# EAGLE design NixieClock (EAGLE 9.5.1)
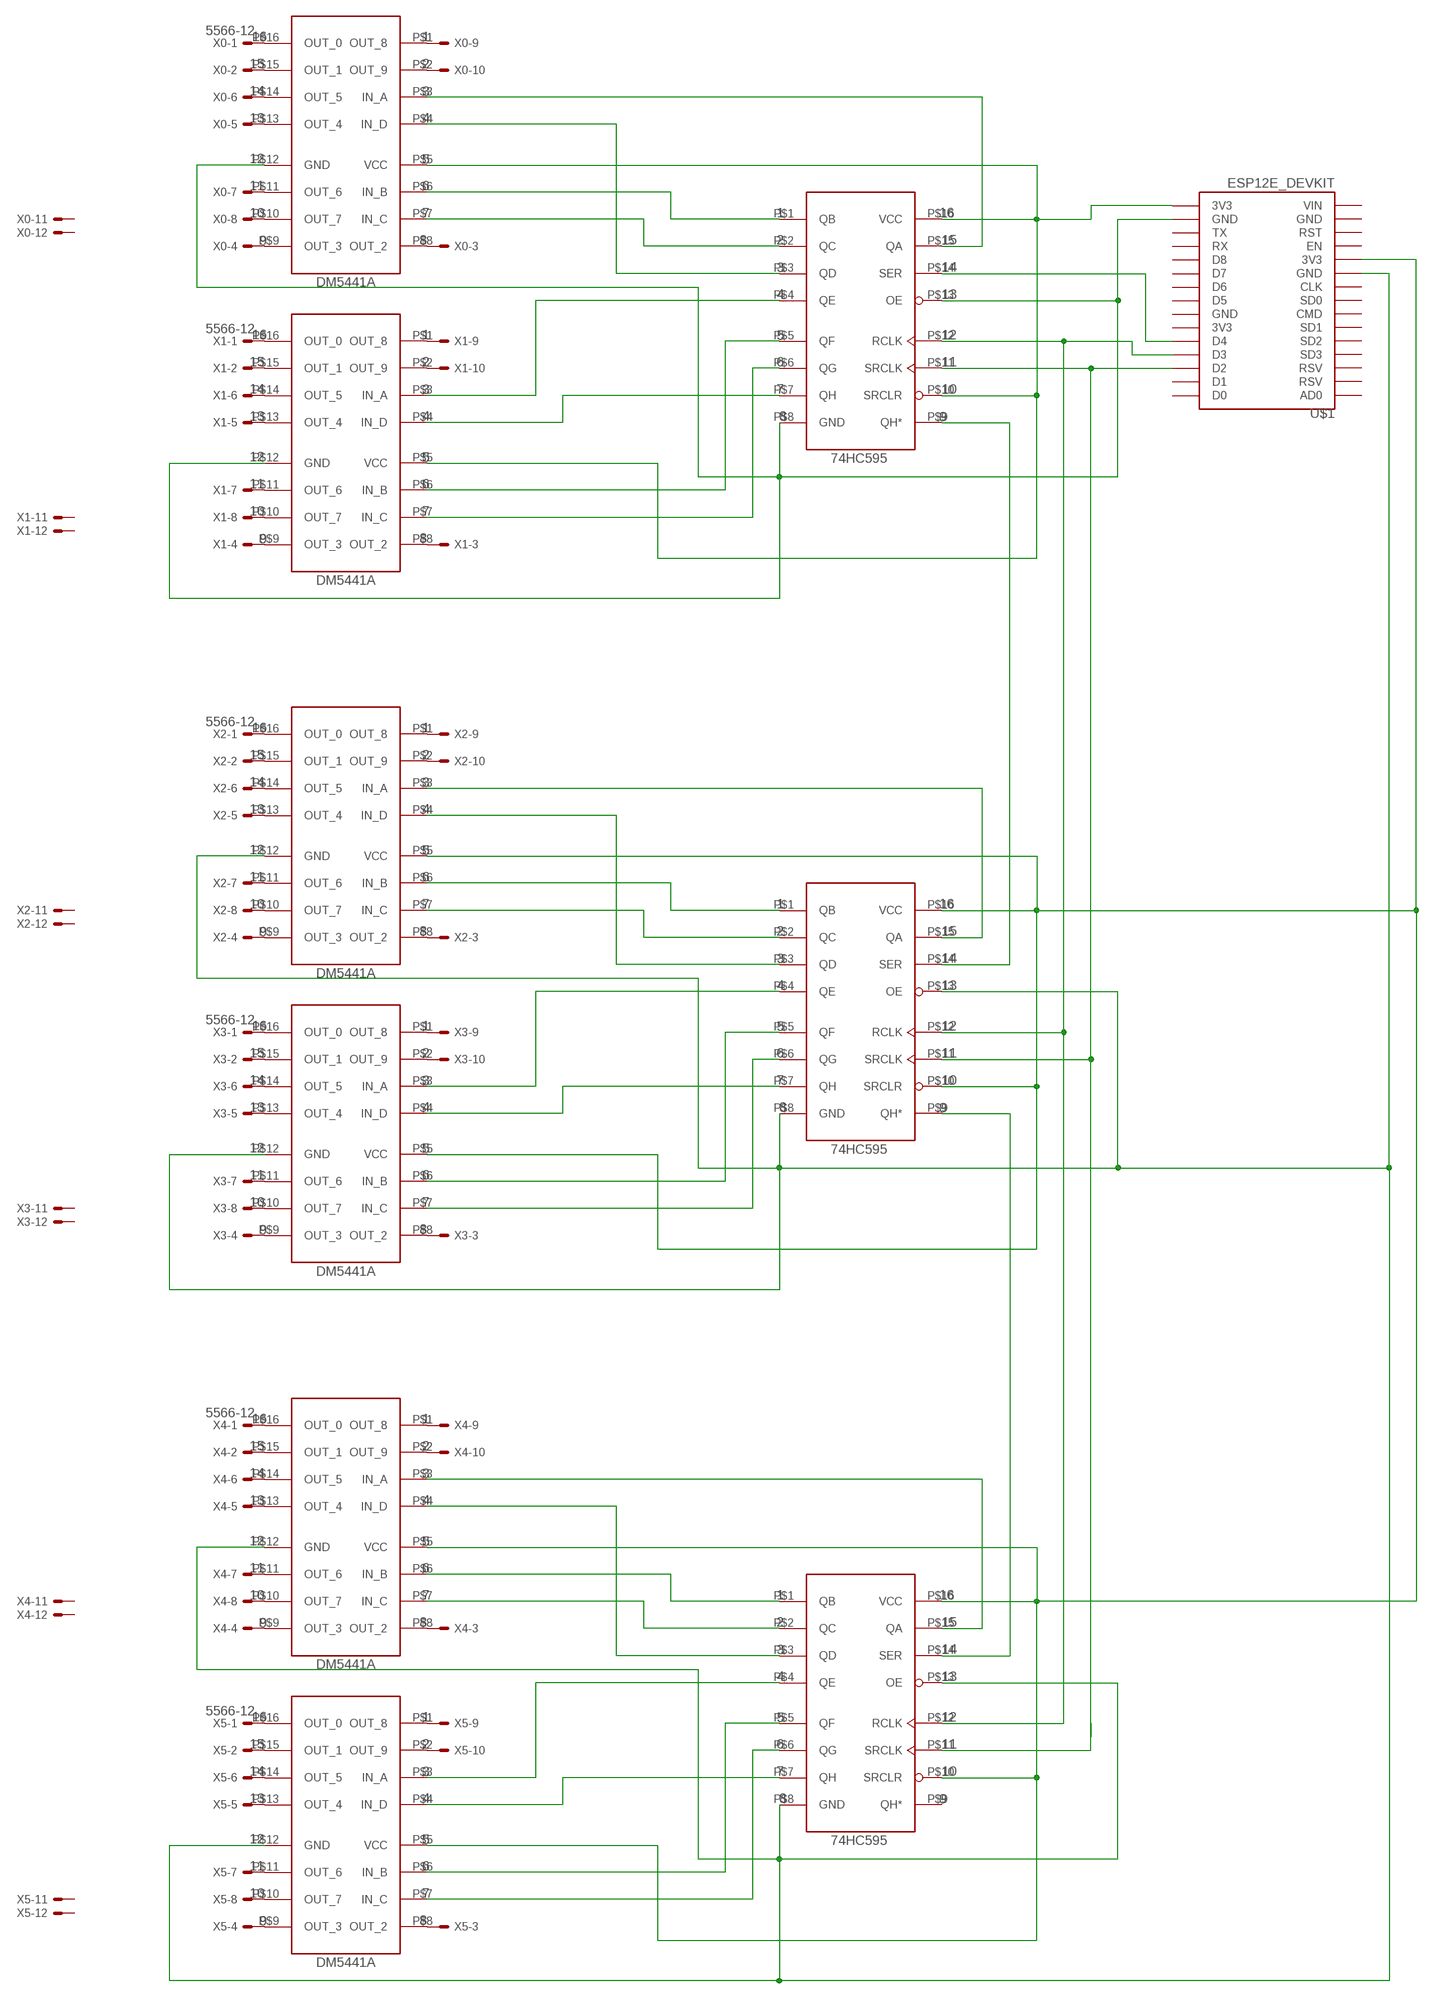
[diagram p0: schematic, sheet 1]

## Parts
BCD0  DM5441ADIP-16  [DIP-16]
BCD1  DM5441ADIP-16  [DIP-16]
BCD2  DM5441ADIP-16  [DIP-16]
BCD3  DM5441ADIP-16  [DIP-16]
BCD4  DM5441ADIP-16  [DIP-16]
BCD5  DM5441ADIP-16  [DIP-16]
SR0  SN74HC595NDIP-16  [DIP-16]
SR1  SN74HC595NDIP-16  [DIP-16]
SR2  SN74HC595NDIP-16  [DIP-16]
U$1  ESP12E_DEVKIT  [ESP12E_DEVKIT]
X0  5566-12  [5566-12]
X1  5566-12  [5566-12]
X2  5566-12  [5566-12]
X3  5566-12  [5566-12]
X4  5566-12  [5566-12]
X5  5566-12  [5566-12]

## Nets
N$1: BCD2.P$3(IN_A) SR1.P$15(QA)
N$3: BCD0.P$3(IN_A) SR0.P$15(QA)
N$4: BCD0.P$6(IN_B) SR0.P$1(QB)
N$5: BCD0.P$7(IN_C) SR0.P$2(QC)
N$6: BCD0.P$4(IN_D) SR0.P$3(QD)
N$7: BCD1.P$3(IN_A) SR0.P$4(QE)
N$8: BCD1.P$6(IN_B) SR0.P$5(QF)
N$9: BCD1.P$7(IN_C) SR0.P$6(QG)
N$10: BCD1.P$4(IN_D) SR0.P$7(QH)
N$11: SR0.P$14(SER) U$1.D4
N$12: BCD0.P$8(OUT_2) X0.3
N$13: BCD2.P$5(VCC) BCD3.P$5(VCC) BCD4.P$5(VCC) BCD5.P$5(VCC) SR1.P$10(SRCLR) SR1.P$16(VCC) SR2.P$10(SRCLR) SR2.P$16(VCC) U$1.3V3@0(3V3)
N$14: BCD0.P$11(OUT_6) X0.7
N$15: BCD0.P$10(OUT_7) X0.8
N$16: BCD0.P$9(OUT_3) X0.4
N$17: BCD0.P$2(OUT_9) X0.10
N$18: BCD0.P$1(OUT_8) X0.9
N$19: BCD0.P$16(OUT_0) X0.1
N$20: BCD0.P$15(OUT_1) X0.2
N$21: BCD0.P$14(OUT_5) X0.6
N$22: BCD0.P$13(OUT_4) X0.5
N$23: BCD2.P$12(GND) BCD3.P$12(GND) BCD4.P$12(GND) BCD5.P$12(GND) SR1.P$8(GND) SR1.P$13(OE) SR2.P$8(GND) SR2.P$13(OE) U$1.GND@0(GND)
N$25: BCD2.P$6(IN_B) SR1.P$1(QB)
N$26: BCD2.P$7(IN_C) SR1.P$2(QC)
N$27: SR0.P$9(QH*) SR1.P$14(SER)
N$28: BCD2.P$4(IN_D) SR1.P$3(QD)
N$29: BCD3.P$3(IN_A) SR1.P$4(QE)
N$30: BCD1.P$8(OUT_2) X1.3
N$31: BCD1.P$11(OUT_6) X1.7
N$32: BCD1.P$10(OUT_7) X1.8
N$33: BCD1.P$9(OUT_3) X1.4
N$34: BCD1.P$2(OUT_9) X1.10
N$35: BCD1.P$1(OUT_8) X1.9
N$36: BCD1.P$16(OUT_0) X1.1
N$37: BCD1.P$15(OUT_1) X1.2
N$38: BCD1.P$14(OUT_5) X1.6
N$39: BCD1.P$13(OUT_4) X1.5
N$40: BCD3.P$6(IN_B) SR1.P$5(QF)
N$41: BCD3.P$7(IN_C) SR1.P$6(QG)
N$42: BCD3.P$4(IN_D) SR1.P$7(QH)
N$43: SR0.P$11(SRCLK) SR1.P$11(SRCLK) SR2.P$11(SRCLK) U$1.D2
N$44: BCD0.P$5(VCC) BCD1.P$5(VCC) SR0.P$10(SRCLR) SR0.P$16(VCC) U$1.3V3@2(3V3)
N$45: BCD0.P$12(GND) BCD1.P$12(GND) SR0.P$8(GND) SR0.P$13(OE) U$1.GND@3(GND)
N$46: SR1.P$9(QH*) SR2.P$14(SER)
N$47: BCD2.P$8(OUT_2) X2.3
N$48: BCD2.P$11(OUT_6) X2.7
N$49: BCD2.P$10(OUT_7) X2.8
N$50: BCD2.P$9(OUT_3) X2.4
N$51: BCD2.P$2(OUT_9) X2.10
N$52: BCD2.P$1(OUT_8) X2.9
N$53: BCD2.P$16(OUT_0) X2.1
N$54: BCD2.P$15(OUT_1) X2.2
N$55: BCD2.P$14(OUT_5) X2.6
N$56: BCD2.P$13(OUT_4) X2.5
N$58: BCD3.P$8(OUT_2) X3.3
N$59: BCD3.P$11(OUT_6) X3.7
N$60: BCD3.P$10(OUT_7) X3.8
N$61: BCD3.P$9(OUT_3) X3.4
N$62: BCD3.P$2(OUT_9) X3.10
N$63: BCD3.P$1(OUT_8) X3.9
N$64: BCD3.P$16(OUT_0) X3.1
N$65: BCD3.P$15(OUT_1) X3.2
N$66: BCD3.P$14(OUT_5) X3.6
N$67: BCD3.P$13(OUT_4) X3.5
N$69: BCD4.P$3(IN_A) SR2.P$15(QA)
N$70: BCD4.P$6(IN_B) SR2.P$1(QB)
N$71: BCD4.P$7(IN_C) SR2.P$2(QC)
N$72: BCD4.P$4(IN_D) SR2.P$3(QD)
N$73: BCD5.P$3(IN_A) SR2.P$4(QE)
N$74: BCD5.P$6(IN_B) SR2.P$5(QF)
N$75: BCD5.P$7(IN_C) SR2.P$6(QG)
N$76: BCD5.P$4(IN_D) SR2.P$7(QH)
N$78: SR0.P$12(RCLK) SR1.P$12(RCLK) SR2.P$12(RCLK) U$1.D3
N$81: BCD4.P$8(OUT_2) X4.3
N$82: BCD4.P$11(OUT_6) X4.7
N$83: BCD4.P$10(OUT_7) X4.8
N$84: BCD4.P$9(OUT_3) X4.4
N$85: BCD4.P$2(OUT_9) X4.10
N$86: BCD4.P$1(OUT_8) X4.9
N$87: BCD4.P$16(OUT_0) X4.1
N$88: BCD4.P$15(OUT_1) X4.2
N$89: BCD4.P$14(OUT_5) X4.6
N$90: BCD4.P$13(OUT_4) X4.5
N$92: BCD5.P$8(OUT_2) X5.3
N$93: BCD5.P$11(OUT_6) X5.7
N$94: BCD5.P$10(OUT_7) X5.8
N$95: BCD5.P$9(OUT_3) X5.4
N$96: BCD5.P$2(OUT_9) X5.10
N$97: BCD5.P$1(OUT_8) X5.9
N$98: BCD5.P$16(OUT_0) X5.1
N$99: BCD5.P$15(OUT_1) X5.2
N$100: BCD5.P$14(OUT_5) X5.6
N$101: BCD5.P$13(OUT_4) X5.5
Unconnected: SR2.P$9(QH*) U$1.3V3@1(3V3) U$1.AD0 U$1.CLK U$1.CMD U$1.D0 U$1.D1 U$1.D5 U$1.D6 U$1.D7 U$1.D8 U$1.EN U$1.GND@1(GND) U$1.GND@2(GND) U$1.RST U$1.RSV@0(RSV) U$1.RSV@1(RSV) U$1.RX U$1.SD0 U$1.SD1 U$1.SD2 U$1.SD3 U$1.TX U$1.VIN X0.11 X0.12 X1.11 X1.12 X2.11 X2.12 X3.11 X3.12 X4.11 X4.12 X5.11 X5.12

## Library data of the parts
BCD0 BCD1-BCD5 = DM5441A:DM5441A; AVAILABILITY: Unavailable; DESCRIPTION: Shift Register Single 8 Bit Serial To Serial Parallel 16 Pin Plastic DIP Tube; MF: Texas Instruments; MP: SN74HC595N; PACKAGE: PDIP-16 Texas Instruments; PRICE: None
SR0 SR1 SR2 = SN74HC595N:SN74HC595N; AVAILABILITY: Unavailable; DESCRIPTION: Shift Register Single 8 Bit Serial To Serial Parallel 16 Pin Plastic DIP Tube; MF: Texas Instruments; MP: SN74HC595N; PACKAGE: PDIP-16 Texas Instruments; PRICE: None
U$1 = ESP12E_DEVKIT:ESP12E_DEVKIT: ESP12E DEVKIT BOARD
X0 X1-X5 = con-molex:5566-12: Mini FIT connector 12 pol Source: http://www.molex.com; MF: MOLEX; OC_FARNELL: unknown; OC_NEWARK: unknown

## Board
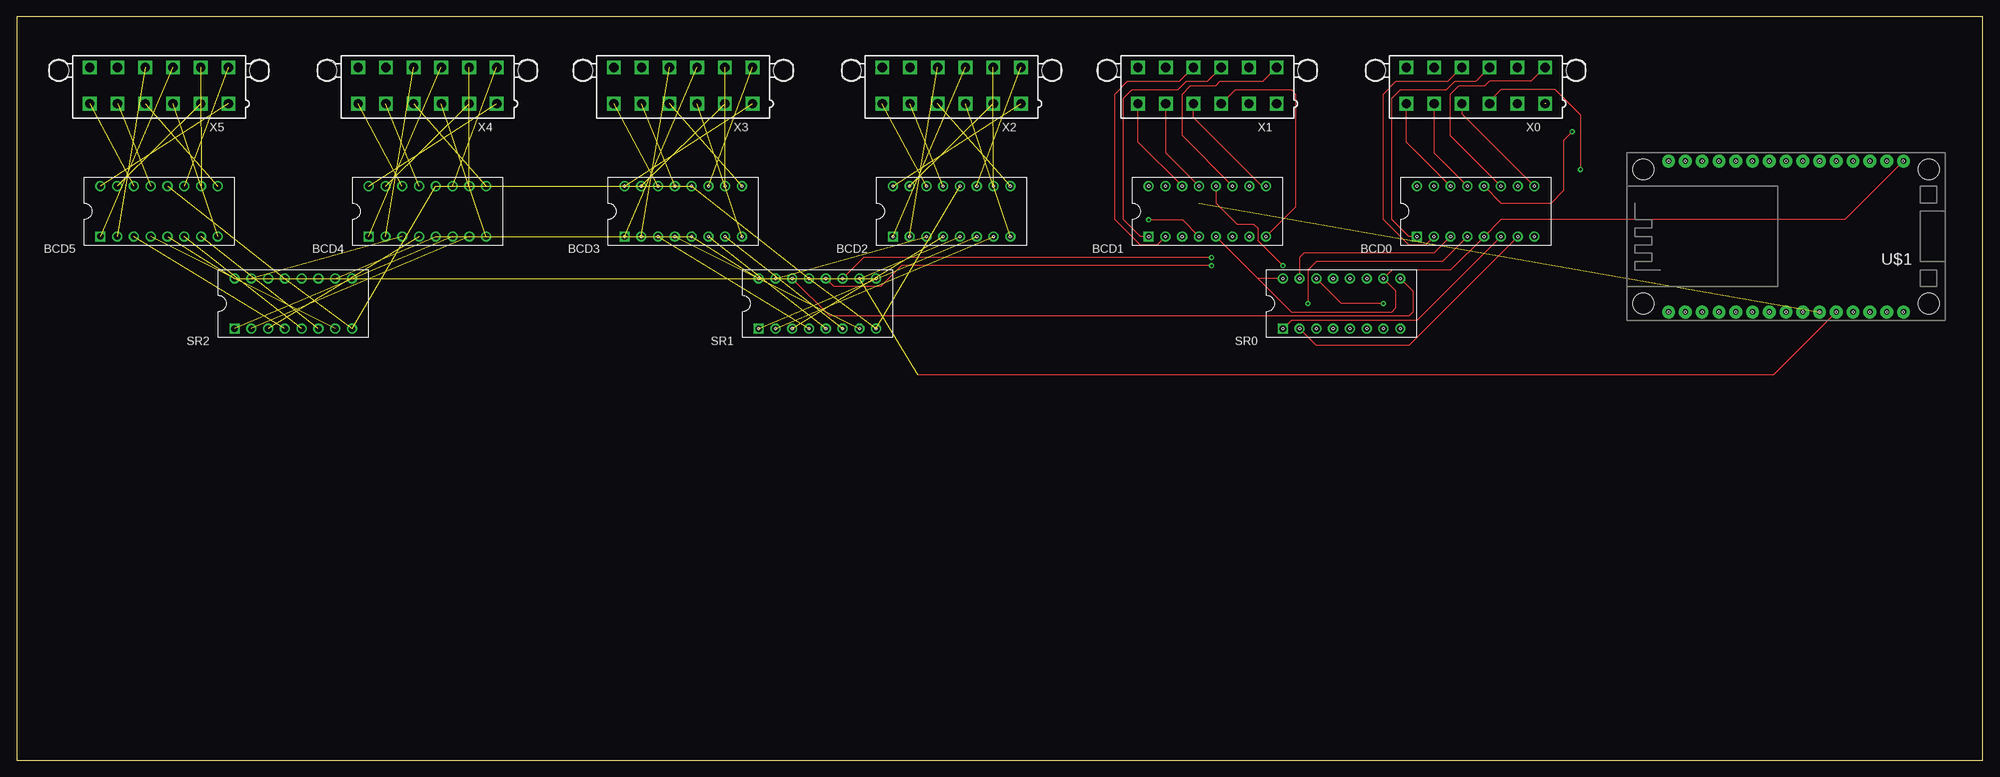
[diagram p1: board, top side]
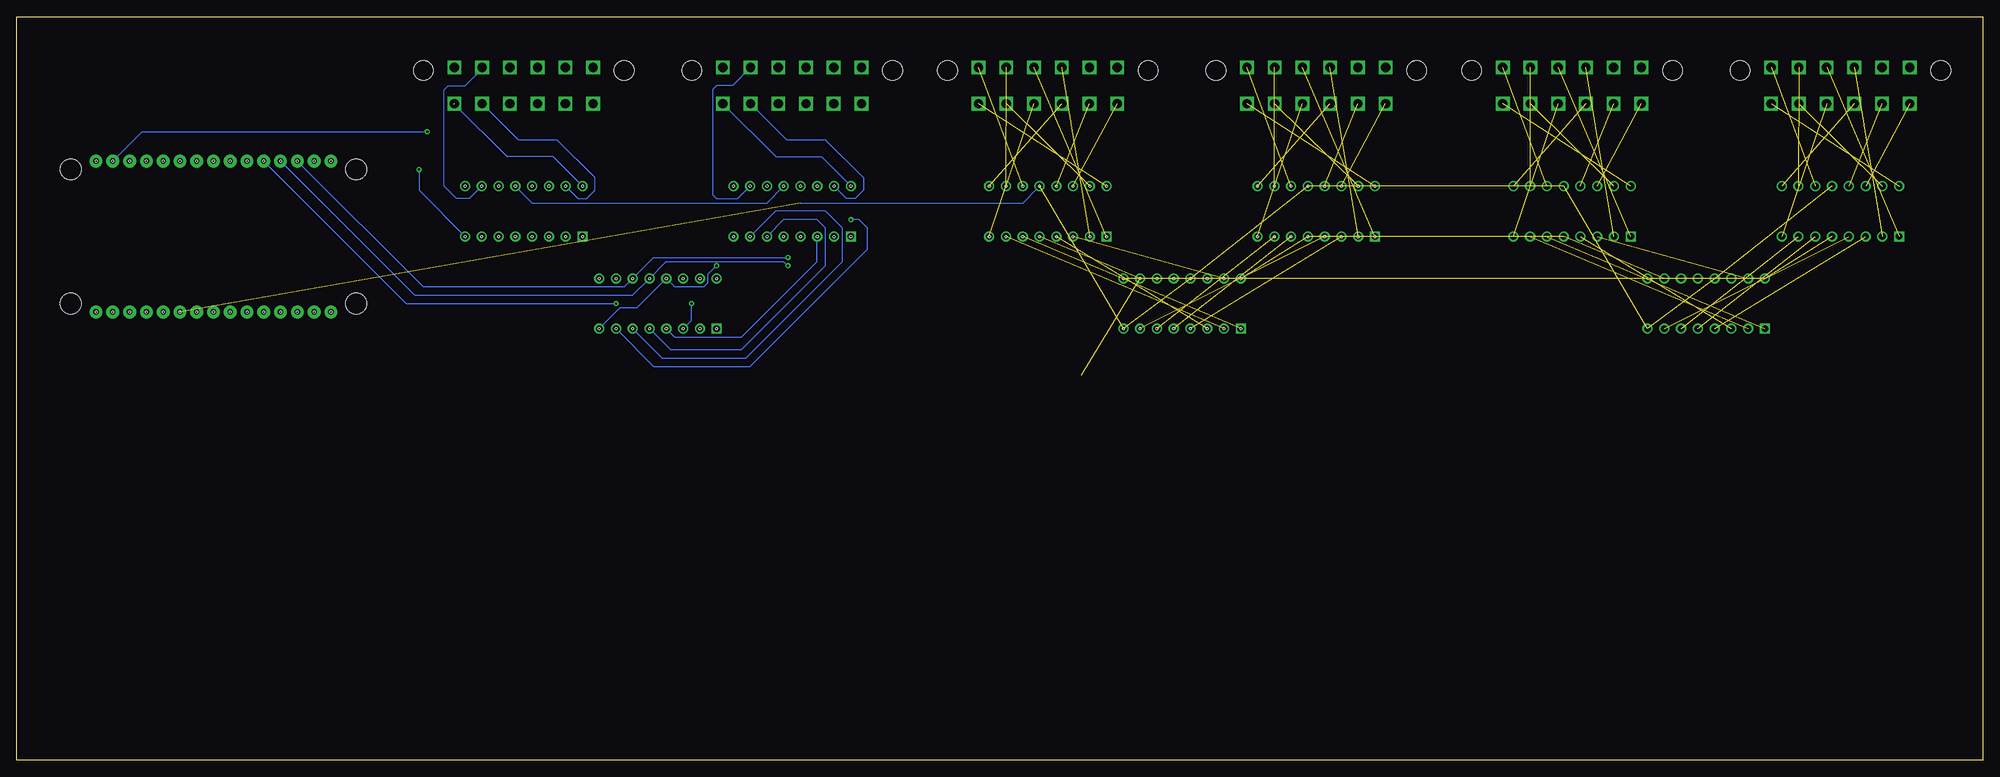
[diagram p2: board, bottom side, seen from below]

Size 297.79 x 112.7 mm. Coordinates in mm from the lower left corner, seen from the top.
Outline: 0,0 297.79,0 297.79,112.7 0,112.7 0,0
Copper layers (1*16): Top 0.035mm / dielectric 1.5mm / Bottom 0.035mm
Design rules "default": minimum track width 6mil, minimum drill 0.35mm, track to track 6mil, track to pad 6mil, pad to pad 6mil, via to via 6mil, smd to smd 6mil, copper to edge 40mil, drill to drill 6mil, minimum pad ring 10mil, minimum via ring 8mil, stop-mask expansion 4mil, vias tented up to drill 0mil, thermal gap 10mil
Holes 0.35 mm at 171.45,86.99 173.99,86.99 176.53,86.99 179.07,86.99 181.61,86.99 184.15,86.99 186.69,86.99 189.23,86.99 189.23,79.38 186.69,79.38 184.15,79.38 181.61,79.38 179.07,79.38 176.53,79.38 173.99,79.38 171.45,79.38 186.69,79.38 212.09,79.38 212.09,86.99 214.63,86.99 217.17,86.99 217.17,79.38 214.63,79.38 219.71,79.38 219.71,86.99 222.25,86.99 224.79,86.99 227.33,86.99 229.87,86.99 229.87,79.38 227.33,79.38 224.79,79.38 222.25,79.38 199.39,65.41 201.93,65.41 204.47,65.41 207.01,65.41 209.55,65.41 196.85,65.41 194.31,65.41 191.77,65.41 191.77,73.03 194.31,73.03 196.85,73.03 199.39,73.03 201.93,73.03 204.47,73.03 207.01,73.03 209.55,73.03 132.72,86.99 135.25,86.99 137.79,86.99 140.33,86.99 142.88,86.99 145.41,86.99 147.95,86.99 150.5,86.99 150.5,79.38 147.95,79.38 145.41,79.38 142.88,79.38 140.33,79.38 137.79,79.38 135.25,79.38 132.72,79.38 130.17,73.03 127.63,73.03 125.09,73.03 122.55,73.03 120.01,73.03 117.47,73.03 114.93,73.03 112.39,73.03 112.39,65.41 114.93,65.41 117.47,65.41 120.01,65.41 122.55,65.41 125.09,65.41 127.63,65.41 130.17,65.41 92.07,86.99 92.07,79.38 94.61,79.38 94.61,86.99 97.16,86.99 97.16,79.38 99.69,79.38 99.69,86.99 102.23,86.99 102.23,79.38 104.77,79.38 104.77,86.99 107.31,86.99 107.31,79.38 109.85,79.38 109.85,86.99 201.93,73.03 199.39,73.03 204.47,73.03

### Footprints (pad centres in the part's own frame; a part is rotated, then mirrored left to right if it is on the bottom)
DIP-16 = drill 1.016 square: P$1 -3.81,8.89 | drill 1.016: P$2 -3.81,6.35; P$3 -3.81,3.81; P$4 -3.81,1.27; P$5 -3.81,-1.27; P$6 -3.81,-3.81; P$7 -3.81,-6.35; P$8 -3.81,-8.89; P$9 3.81,-8.89; P$10 3.81,-6.35; P$11 3.81,-3.81; P$12 3.81,-1.27; P$13 3.81,1.27; P$14 3.81,3.81; P$15 3.81,6.35; P$16 3.81,8.89
ESP12E_DEVKIT = drill 0.8 pad 1.93: 3V3@0 -11.43,-7.62; 3V3@1 11.43,5.08; 3V3@2 11.43,-17.78; AD0 -11.43,17.78; CLK -11.43,-2.54; CMD -11.43,2.54; D0 11.43,17.78; D1 11.43,15.24; D2 11.43,12.7; D3 11.43,10.16; D4 11.43,7.62; D5 11.43,0; D6 11.43,-2.54; D7 11.43,-5.08; D8 11.43,-7.62; EN -11.43,-10.16; GND@0 -11.43,-5.08; GND@1 -11.43,-15.24; GND@2 11.43,2.54; GND@3 11.43,-15.24; RST -11.43,-12.7; RSV@0 -11.43,15.24; RSV@1 -11.43,12.7; RX 11.43,-10.16; SD0 -11.43,0; SD1 -11.43,5.08; SD2 -11.43,7.62; SD3 -11.43,10.16; TX 11.43,-12.7; VIN -11.43,-17.78 | hole 3.2: -10.16,21.59; 10.16,21.59; 10.16,-21.59; -10.16,-21.59 | hole 0.35: -11.43,-17.78; -11.43,-15.24; -11.43,-12.7; -11.43,-10.16; -11.43,-7.62; -11.43,-5.08; -11.43,-2.54; -11.43,0; -11.43,2.54; -11.43,5.08; -11.43,7.62; -11.43,10.16; -11.43,12.7; -11.43,15.24; -11.43,17.78; 11.43,17.78; 11.43,15.24; 11.43,12.7; 11.43,10.16; 11.43,7.62; 11.43,5.08; 11.43,2.54; 11.43,0; 11.43,-2.54; 11.43,-5.08; 11.43,-7.62; 11.43,-10.16; 11.43,-12.7; 11.43,-15.24; 11.43,-17.78
5566-12 = drill 1.4 square: 1 10.5,-2.75; 2 6.3,-2.75; 3 2.1,-2.75; 4 -2.1,-2.75; 5 -6.3,-2.75; 6 -10.5,-2.75; 7 10.5,2.75; 8 6.3,2.75; 9 2.1,2.75; 10 -2.1,2.75; 11 -6.3,2.75; 12 -10.5,2.75 | hole 3: 15.2,2.29; -15.2,2.29

### Placement (x,y rotation side)
BCD0  220.98,83.19 90 top
BCD1  180.34,83.19 90 top
BCD2  141.6,83.19 90 top
BCD3  100.96,83.19 90 top
BCD4  62.23,83.19 90 top
BCD5  21.59,83.19 90 top
SR0  200.66,69.22 90 top
SR1  121.28,69.22 90 top
SR2  41.91,69.22 90 top
U$1  267.97,79.38 90 top
X0  220.98,102.23 0 top
X1  180.34,102.23 0 top
X2  141.6,102.23 0 top
X3  100.96,102.23 0 top
X4  62.23,102.23 0 top
X5  21.59,102.23 0 top

### Tracks (layer width: path | path; a pad name or v marks a point on that pad's centre or on a via)
N$1  (1 unrouted)
N$3
  Top 0.152: BCD0.P$3 214.63,76.83 194.94,76.83 194.31,76.2 SR0.P$15
N$4
  Top 0.152: BCD0.P$6 212.09,66.67 193.04,66.67 SR0.P$1
N$5
  Top 0.152: BCD0.P$7 210.82,62.86 196.85,62.86 SR0.P$2
N$6  (via drill 0.35)
  Top 0.152: BCD0.P$4 215.9,75.56 196.85,75.56 195.58,74.3 v195.58,69.22
  Bottom 0.152: SR0.P$3 195.58,66.67 v195.58,69.22
N$7
  Bottom 0.152: SR0.P$4 198.12,64.14 187.96,64.14 176.53,75.56 BCD1.P$3
N$8
  Bottom 0.152: SR0.P$5 198.75,62.23 187.96,62.23 175.26,74.93 175.26,80.64 176.53,81.91 181.61,81.91 BCD1.P$6
N$9
  Bottom 0.152: SR0.P$6 200.02,60.96 187.32,60.96 172.72,75.56 172.72,80.64 175.26,83.19 182.88,83.19 BCD1.P$7
N$10  (via drill 0.35)
  Top 0.152: v171.45,81.91 176.53,81.91 BCD1.P$4
  Bottom 0.152: SR0.P$7 201.29,59.69 186.69,59.69 168.91,77.47 168.91,80.64 170.18,81.91 v171.45,81.91
N$11  (via drill 0.35)
  Top 0.152: v207.01,69.22 200.66,69.22 SR0.P$14
  Bottom 0.152: U$1.D4 238.76,69.22 v207.01,69.22
N$12  (via drill 0.35)
  Top 0.152: X0.3 223.08,99.89 224.79,101.6 233.04,101.6 236.85,97.79 v236.85,89.53
  Bottom 0.152: BCD0.P$8 236.85,86.36 v236.85,89.53
N$13  (8 unrouted)
  Top 0.152: U$1.3V3@0 266.06,58.42 136.53,58.42
N$14
  Top 0.152: BCD0.P$11 217.17,94.61 217.17,100.97 218.44,102.23 222.38,102.23 223.01,102.87 229.37,102.87 X0.7
N$15
  Top 0.152: X0.8 227.28,104.83
  Bottom 0.152: 227.28,104.72 227.28,104.77 | 227.28,104.77 X0.8 | BCD0.P$10 229.24,85.09 231.14,85.09 233.04,86.99 233.04,101.6 232.41,102.23 229.82,102.23 227.28,104.77
N$16
  Top 0.152: X0.4 218.88,97.98 BCD0.P$9
N$17
  Top 0.152: BCD0.P$2 213.36,78.1 210.82,78.1 207.01,81.91 207.01,100.97 208.91,102.87 216.76,102.87 X0.10
N$18
  Top 0.152: BCD0.P$1 210.82,79.38 208.28,81.91 208.28,100.33 209.55,101.6 216.53,101.6 217.81,102.87 220.98,102.87 221.27,103.16 221.27,103.17 X0.9
N$19  (1 unrouted)
  Bottom 0.152: BCD0.P$16 216.53,91.44 223.52,91.44 231.56,99.48
N$20
  Bottom 0.152: BCD0.P$15 212.72,85.09 211.45,85.09 210.19,86.36 210.19,88.27 215.9,93.98 221.77,93.98 X0.2
N$21
  Top 0.152: X0.6 210.48,93.69 BCD0.P$14
N$22
  Top 0.152: BCD0.P$13 214.68,92.02 X0.5
N$23  (8 unrouted)
  Bottom 0.152: BCD2.P$12 145.41,84.45 179.07,84.45
N$25  (1 unrouted)
N$26  (1 unrouted)
N$27
  Top 0.152: SR0.P$9 211.45,71.12 211.45,67.94 210.82,67.31 123.19,67.31 SR1.P$14
N$28  (1 unrouted)
N$29  (1 unrouted)
N$30
  Top 0.152: X1.3 184.56,101.6 193.04,101.6 193.67,100.97 193.67,83.82 BCD1.P$8
N$31
  Top 0.152: BCD1.P$11 176.53,94.61 176.53,100.97 177.8,102.23 181.61,102.23 182.25,102.87 188.72,102.87 X1.7
N$32
  Bottom 0.152: X1.8 189.39,102.23 191.77,102.23 192.41,101.6 192.41,85.72 191.77,85.09 188.59,85.09 BCD1.P$10
N$33
  Top 0.152: X1.4 178.24,97.35 188.59,86.99 BCD1.P$9
N$34
  Top 0.152: BCD1.P$2 172.72,78.1 170.18,78.1 166.37,81.91 166.37,100.97 168.27,102.87 176.12,102.87 X1.10
N$35
  Top 0.152: BCD1.P$1 170.18,79.38 167.64,81.91 167.64,100.33 168.91,101.6 175.89,101.6 177.16,102.87 180.34,102.87 182.44,104.97 X1.9
N$36
  Bottom 0.152: BCD1.P$16 175.89,91.44 182.79,91.44 X1.1
N$37
  Bottom 0.152: BCD1.P$15 172.08,85.09 170.81,85.09 169.54,86.36 169.54,88.27 175.26,93.98 181.13,93.98 X1.2
N$38
  Top 0.152: X1.6 169.84,93.69 BCD1.P$14
N$39
  Top 0.152: BCD1.P$13 174.04,92.02 X1.5
N$40  (1 unrouted)
N$41  (1 unrouted)
N$42  (1 unrouted)
N$43  (via drill 0.35)  (1 unrouted)
  Top 0.152: v180.97,76.2 128.27,76.2 SR1.P$11
  Bottom 0.152: U$1.D2 236.22,71.75 205.74,71.75 SR0.P$11 201.29,76.2 v180.97,76.2
N$44
  Top 0.152: U$1.3V3@2 276.86,81.91 224.79,81.91 BCD0.P$5 217.17,74.3 208.28,74.3 SR0.P$10 208.91,71.12 208.91,68.58 208.28,67.94 193.04,67.94 BCD1.P$5 187.96,73.03 SR0.P$16
N$45  (via drill 0.35)
  Top 0.152: BCD1.P$12 181.61,84.45 184.78,81.28 187.32,81.28 187.96,80.64 187.96,78.74 v191.77,74.93 | v235.58,95.25 234.31,93.98 234.31,86.36 232.41,84.45 224.79,84.45 BCD0.P$12
  Bottom 0.152: BCD0.P$12 219.71,84.45 184.15,84.45 BCD1.P$12 | SR0.P$8 206.38,68.58 203.83,68.58 SR0.P$13 198.12,71.75 193.67,71.75 193.04,72.39 193.04,73.66 v191.77,74.93 | U$1.GND@3 278.76,95.25 v235.58,95.25
N$46  (1 unrouted)
N$47  (1 unrouted)
N$48  (1 unrouted)
N$49  (1 unrouted)
N$50  (1 unrouted)
N$51  (1 unrouted)
N$52  (1 unrouted)
N$53  (1 unrouted)
N$54  (1 unrouted)
N$55  (1 unrouted)
N$56  (1 unrouted)
N$58  (1 unrouted)
N$59  (1 unrouted)
N$60  (1 unrouted)
N$61  (1 unrouted)
N$62  (1 unrouted)
N$63  (1 unrouted)
N$64  (1 unrouted)
N$65  (1 unrouted)
N$66  (1 unrouted)
N$67  (1 unrouted)
N$69  (1 unrouted)
N$70  (1 unrouted)
N$71  (1 unrouted)
N$72  (1 unrouted)
N$73  (1 unrouted)
N$74  (1 unrouted)
N$75  (1 unrouted)
N$76  (1 unrouted)
N$78  (via drill 0.35)  (1 unrouted)
  Top 0.152: v180.97,74.93 133.98,74.93 130.81,71.75 123.82,71.75 SR1.P$12
  Bottom 0.152: U$1.D3 237.49,70.48 204.47,70.48 SR0.P$12 199.39,75.56 181.61,75.56 v180.97,74.93
N$81  (1 unrouted)
N$82  (1 unrouted)
N$83  (1 unrouted)
N$84  (1 unrouted)
N$85  (1 unrouted)
N$86  (1 unrouted)
N$87  (1 unrouted)
N$88  (1 unrouted)
N$89  (1 unrouted)
N$90  (1 unrouted)
N$92  (1 unrouted)
N$93  (1 unrouted)
N$94  (1 unrouted)
N$95  (1 unrouted)
N$96  (1 unrouted)
N$97  (1 unrouted)
N$98  (1 unrouted)
N$99  (1 unrouted)
N$100  (1 unrouted)
N$101  (1 unrouted)